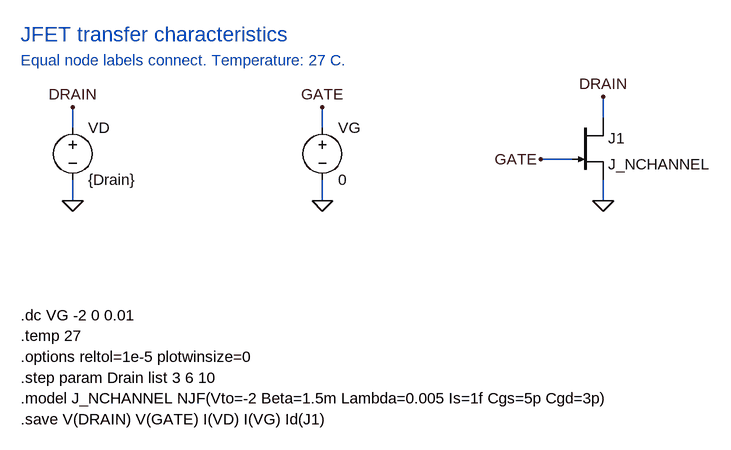
[diagram p0: schematic jfet-transfer-curves.asc]
jfet-transfer-curves.asc, the LTspice schematic file:
Version 4
SHEET 1 1740 776
WIRE 144 176 144 144
WIRE 144 256 144 288
WIRE 528 176 528 144
WIRE 528 256 528 288
WIRE 960 160 960 128
WIRE 912 224 864 224
WIRE 960 256 960 288
FLAG 144 144 DRAIN
FLAG 144 288 0
FLAG 528 144 GATE
FLAG 528 288 0
FLAG 960 128 DRAIN
FLAG 864 224 GATE
FLAG 960 288 0
SYMBOL voltage 144 160 R0
SYMATTR InstName VD
SYMATTR Value {Drain}
SYMBOL voltage 528 160 R0
SYMATTR InstName VG
SYMATTR Value 0
SYMBOL njf 912 160 R0
SYMATTR InstName J1
SYMATTR Value J_NCHANNEL
TEXT 64 32 Left 3 ;JFET transfer characteristics
TEXT 64 72 Left 2 ;Equal node labels connect. Temperature: 27 C.
TEXT 64 464 Left 2 !.dc VG -2 0 0.01
TEXT 64 496 Left 2 !.temp 27
TEXT 64 528 Left 2 !.options reltol=1e-5 plotwinsize=0
TEXT 64 560 Left 2 !.step param Drain list 3 6 10
TEXT 64 592 Left 2 !.model J_NCHANNEL NJF(Vto=-2 Beta=1.5m Lambda=0.005 Is=1f Cgs=5p Cgd=3p)
TEXT 64 624 Left 2 !.save V(DRAIN) V(GATE) I(VD) I(VG) Id(J1)

The netlist it stands for:
* jfet-transfer-curves.asc
VD DRAIN 0 {Drain}
VG GATE 0 0
J1 DRAIN GATE 0 J_NCHANNEL
.model NJF NJF
.model PJF PJF
.lib standard.jft
* JFET transfer characteristics
* Equal node labels connect. Temperature: 27 C.
.dc VG -2 0 0.01
.temp 27
.options reltol=1e-5 plotwinsize=0
.step param Drain list 3 6 10
.model J_NCHANNEL NJF(Vto=-2 Beta=1.5m Lambda=0.005 Is=1f Cgs=5p Cgd=3p)
.save V(DRAIN) V(GATE) I(VD) I(VG) Id(J1)
.backanno
.end